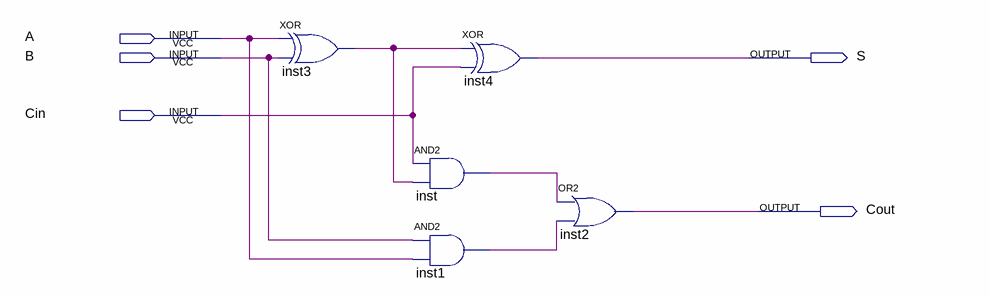
[diagram p0: schematic sheet]
// Quartus schematic FA.bdf as structural Verilog: 5 symbols, 5 pins
module FA (
  input  A,
  input  B,
  input  Cin,
  output S,
  output Cout
);

  wire inst1_out, inst3_out, inst_out;

  xor inst3 (inst3_out, A, B);
  xor inst4 (S, inst3_out, Cin);
  and inst (inst_out, Cin, inst3_out);
  and inst1 (inst1_out, B, A);
  or inst2 (Cout, inst_out, inst1_out);
endmodule
